# Altium schematic sheet Multi2Meter - Copy.SchDoc
size A4
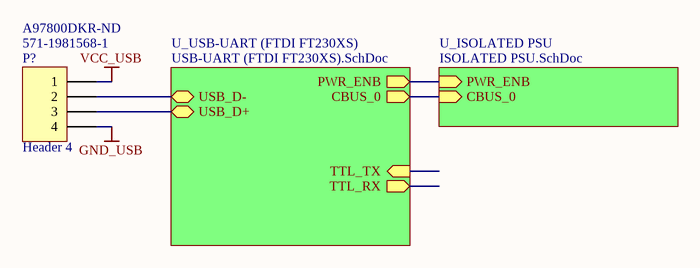
[diagram p0: Multi2Meter - Copy.SchDoc]

## Parts
P?  Header 4  Supplier Part Number 1: 571-1981568-1  Supplier Part Number 2: A97800DKR-ND  [MICRO USB]

## Sub-sheets
U_ISOLATED PSU = ISOLATED PSU.SchDoc: PWR_ENB (in), CBUS_0 (in)
U_USB-UART (FTDI FT230XS) = USB-UART (FTDI FT230XS).SchDoc: TTL_TX (in), TTL_RX (out), PWR_ENB (out), CBUS_0 (out), USB_D- (bidir), USB_D+ (bidir)

## Nets
GND_USB: P?.4
VCC_USB: P?.1
NetP?_2: P?.2 ; sheet U_USB-UART (FTDI FT230XS)/USB_D-
NetP?_3: P?.3 ; sheet U_USB-UART (FTDI FT230XS)/USB_D+
(unnamed): sheet U_ISOLATED PSU/PWR_ENB, sheet U_USB-UART (FTDI FT230XS)/PWR_ENB
(unnamed): sheet U_ISOLATED PSU/CBUS_0, sheet U_USB-UART (FTDI FT230XS)/CBUS_0

## Library data of the parts
P? = Header 4: Header, 4-Pin; LatestRevisionDate: 17-Jul-2002; LatestRevisionNote: Re-released for DXP Platform.; Publisher: Altium Limited; Supplier 1: Mouser; Supplier 2: Digi-Key